# EAGLE board octanis_v1 (EAGLE 7.2.0)
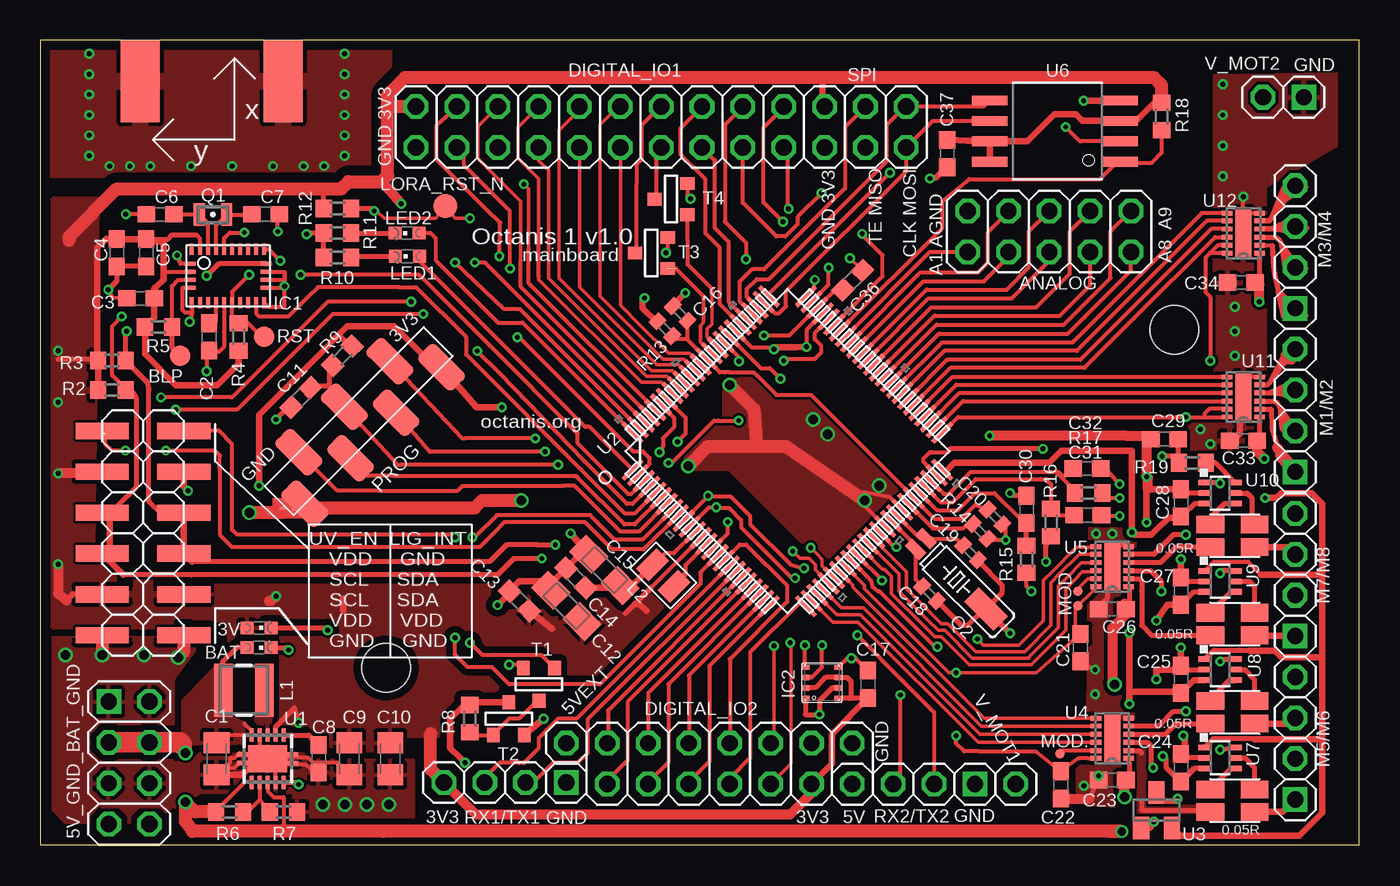
[diagram p2: board, top side]
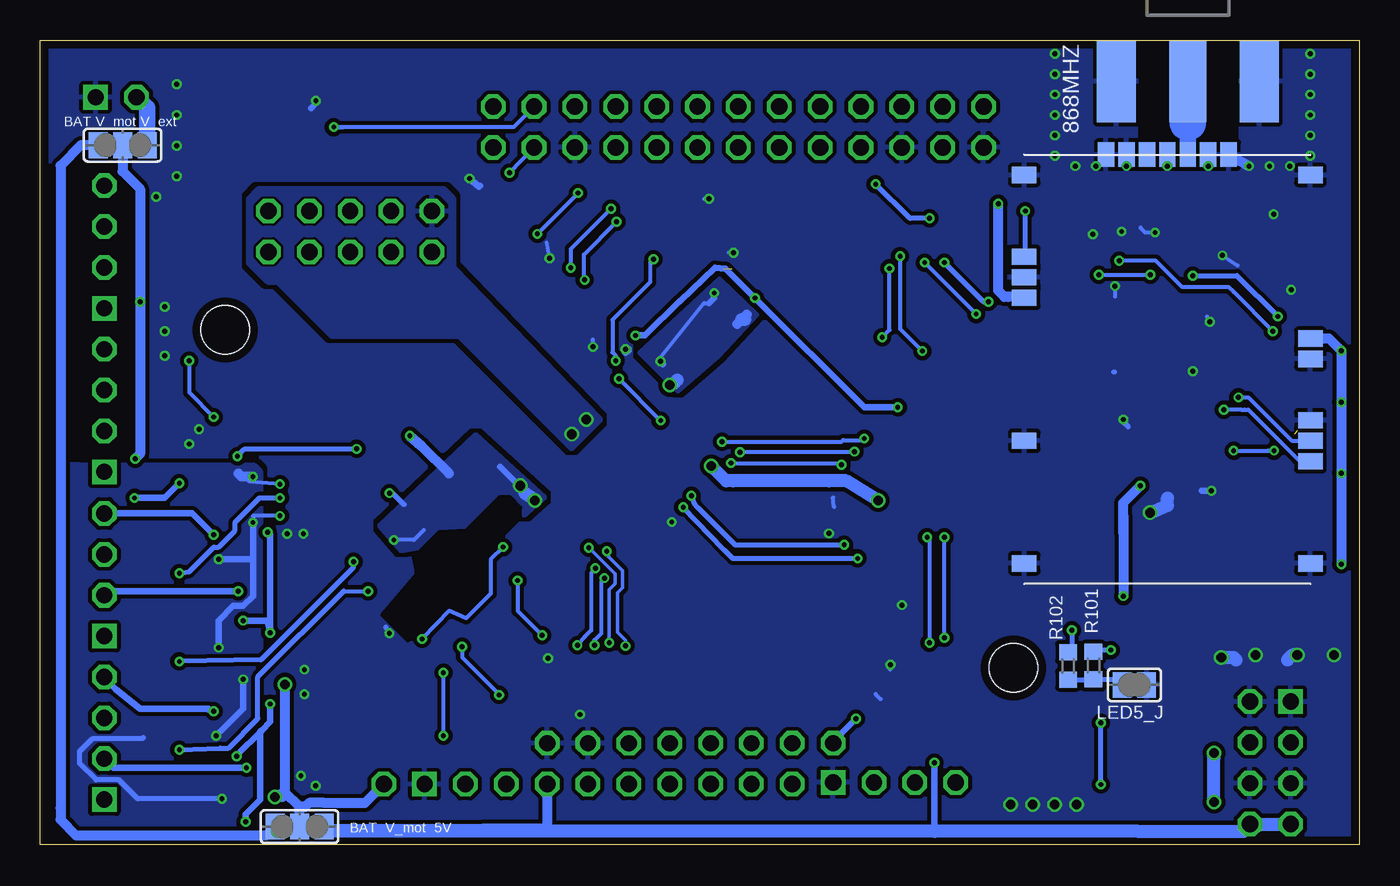
[diagram p3: board, bottom side, seen from below]

Size 82 x 50 mm. Coordinates in mm from the lower left corner, seen from the top.
Outline: 0,0 82,0 82,50 0,50 0,0
Copper layers (1*16): Top 0.035mm / dielectric 1.6mm / Bottom 0.035mm
Design rules "Elecrow_2-layer_PCB_eagle_rule": minimum track width 6mil, minimum drill 12mil, track to track 6mil, track to pad 6mil, pad to pad 6mil, via to via 8mil, smd to smd 0mil, copper to edge 20mil, drill to drill 10mil, minimum pad ring 6mil, minimum via ring 6mil, stop-mask expansion 0mil, vias tented up to drill 100mil, thermal gap 10mil
Net classes: 0 default: width 0.203 mm; 1 power: width 0.203 mm, drill 0.305 mm, clearance 0.152 mm; 2 VIN: width 0.203 mm, drill 0.305 mm, clearance 0.152 mm; 3 fine: width 0.406 mm, drill 0.61 mm, clearance 0.152 mm
Holes 3 mm at 70.5,32 21.5,11

## Footprints (pad centres in the part's own frame; a part is rotated, then mirrored left to right if it is on the bottom)
CHIPLED_0603 = smd 0.8 x 0.8: A 0,-0.75; C 0,0.75
1X01 = drill 1.016 octagon: 1 0,0
SMA_EDGELAUNCH = smd 5.08 x 2.413: GND@1 2.54,-4.445; GND@2 2.54,4.445 | smd 5.08 x 2.413 bottom: GND@3 2.54,4.445; GND@4 2.54,-4.445 | smd 5.08 x 2.286: P 2.54,0
2X05 = drill 1.016 octagon: 1 -5.08,-1.27; 2 -5.08,1.27; 3 -2.54,-1.27; 4 -2.54,1.27; 5 0,-1.27; 6 0,1.27; 7 2.54,-1.27; 8 2.54,1.27; 9 5.08,-1.27; 10 5.08,1.27
B1,27 = smd 1.27 x 1.27: TP 0,0
C0805K = smd 1.3 x 1.6: 1 -1,0; 2 1,0
C0603 = smd 1.1 x 1: 1 -0.85,0; 2 0.85,0
A/3216-18R = smd 1.95 x 1.5: + 1.375,0; - -1.375,0
C0402 = smd 0.7 x 0.9: 1 -0.65,0; 2 0.65,0
2X11 = drill 1.016 octagon: 1 -12.7,-1.27; 2 -12.7,1.27; 3 -10.16,-1.27; 4 -10.16,1.27; 5 -7.62,-1.27; 6 -7.62,1.27; 7 -5.08,-1.27; 8 -5.08,1.27; 9 -2.54,-1.27; 10 -2.54,1.27; 11 0,-1.27; 12 0,1.27; 13 2.54,-1.27; 14 2.54,1.27; 15 5.08,-1.27; 16 5.08,1.27; 17 7.62,-1.27; 18 7.62,1.27; 19 10.16,-1.27; 20 10.16,1.27; 21 12.7,-1.27; 22 12.7,1.27
BNO055 = smd 0.675 x 0.25: 1 1.663,2.25; 6 -1.665,2.25; 7 -1.665,1.75; 8 -1.665,1.25; 9 -1.665,0.75; 10 -1.665,0.25; 11 -1.665,-0.25; 12 -1.665,-0.75; 13 -1.665,-1.25; 14 -1.665,-1.75; 15 -1.665,-2.25; 20 1.663,-2.25; 21 1.663,-1.75; 22 1.663,-1.25; 23 1.663,-0.75; 24 1.663,-0.25; 25 1.663,0.25; 26 1.663,0.75; 27 1.663,1.25; 28 1.663,1.75 | smd 0.25 x 0.675: 2 0.75,2.362; 3 0.25,2.362; 4 -0.25,2.362; 5 -0.75,2.362; 16 -0.75,-2.362; 17 -0.25,-2.362; 18 0.25,-2.362; 19 0.75,-2.362
BME280 = smd 0.35 x 0.5: 1 0.975,-1.025; 2 0.325,-1.025; 3 -0.325,-1.025; 4 -0.975,-1.025; 5 -0.975,1.025; 6 -0.325,1.025; 7 0.325,1.025; 8 0.975,1.025
2X04 = drill 1.016 square: 1 -3.81,-1.27 | drill 1.016 octagon: 2 -3.81,1.27; 3 -1.27,-1.27; 4 -1.27,1.27; 5 1.27,-1.27; 6 1.27,1.27; 7 3.81,-1.27; 8 3.81,1.27
2X02 = drill 1.016 octagon: 1 -1.27,-1.27; 2 -1.27,1.27; 3 1.27,-1.27; 4 1.27,1.27
2X06SMD = smd 1.016 x 3.302: 1 -1.27,-3.81; 2 -1.27,1.27; 3 1.27,-3.81; 4 1.27,1.27; 5 3.81,-3.81; 6 3.81,1.27; 7 6.35,-3.81; 8 6.35,1.27; 9 8.89,-3.81; 10 8.89,1.27; 11 11.43,-3.81; 12 11.43,1.27
LPS3015 = smd 1.14 x 3.3: 1 -1.27,0; 2 1.27,0
0806 = smd 1.1 x 1.8: 1 -0.94,0; 2 0.94,0
SJ = smd 1.168 x 1.6: 1 -0.762,0; 2 0.762,0
TP15R = smd 1.5 x 1.5: TP 0,0
1X04-S = drill 1.016 square: 1 -3.81,0 | drill 1.016 octagon: 2 -1.27,0; 3 1.27,0; 4 3.81,0
TP06R = smd 0.6 x 0.6: TP 0,0
1X7SMD = smd 3.048 x 1.524: 1 -1.27,6; 2 1.27,4; 3 -1.27,2; 4 1.27,0; 5 -1.27,-2; 6 1.27,-4; 7 -1.27,-6
FC-12M = smd 0.7 x 1.4: 1 -0.85,0; 2 0.85,0
MS3V-T1R = smd 0.635 x 1.27: P1 -0.47,-4.43; P2 0.47,-4.43 | smd 1.27 x 2.54: P3 0,1.3
R0603 = smd 1 x 1.1: 1 -0.85,0; 2 0.85,0
R0402 = smd 0.7 x 0.9: 1 -0.65,0; 2 0.65,0
4PADS_RESISTOR = smd 1.727 x 1.1: I1 0,0; I2 2.751,0; V1 0,1.4; V2 2.751,1.4
SOT-23 = smd 0.787 x 0.889: 1 0.025,-1.016; 2 -0.94,1.016; 3 0.991,1.016
S-PDSO-N10 = smd 0.28 x 0.85: 1 -1,-1.475; 2 -0.5,-1.475; 3 0,-1.475; 4 0.5,-1.475; 5 1,-1.475; 6 1,1.475; 7 0.5,1.475; 8 0,1.475; 9 -0.5,1.475; 10 -1,1.475 | smd 2.4 x 1.65: PP 0,0 | smd 3.8 x 0.28: PP@1 0,0.275; PP@2 0,-0.275
PZ100 = smd 1.676 x 0.279: 1 -7.62,5.994; 2 -7.62,5.512; 3 -7.62,5.004; 4 -7.62,4.496; 5 -7.62,3.988; 6 -7.62,3.505; 7 -7.62,2.997; 8 -7.62,2.489; 9 -7.62,2.007; 10 -7.62,1.499; 11 -7.62,0.991; 12 -7.62,0.508; 13 -7.62,0; 14 -7.62,-0.508; 15 -7.62,-0.991; 16 -7.62,-1.499; 17 -7.62,-2.007; 18 -7.62,-2.489; 19 -7.62,-2.997; 20 -7.62,-3.505; 21 -7.62,-3.988; 22 -7.62,-4.496; 23 -7.62,-5.004; 24 -7.62,-5.512; 25 -7.62,-5.994; 51 7.62,-5.994; 52 7.62,-5.512; 53 7.62,-5.004; 54 7.62,-4.496; 55 7.62,-3.988; 56 7.62,-3.505; 57 7.62,-2.997; 58 7.62,-2.489; 59 7.62,-2.007; 60 7.62,-1.499; 61 7.62,-0.991; 62 7.62,-0.508; 63 7.62,0; 64 7.62,0.508; 65 7.62,0.991; 66 7.62,1.499; 67 7.62,2.007; 68 7.62,2.489; 69 7.62,2.997; 70 7.62,3.505; 71 7.62,3.988; 72 7.62,4.496; 73 7.62,5.004; 74 7.62,5.512; 75 7.62,5.994 | smd 0.279 x 1.676: 26 -5.994,-7.62; 27 -5.512,-7.62; 28 -5.004,-7.62; 29 -4.496,-7.62; 30 -3.988,-7.62; 31 -3.505,-7.62; 32 -2.997,-7.62; 33 -2.489,-7.62; 34 -2.007,-7.62; 35 -1.499,-7.62; 36 -0.991,-7.62; 37 -0.508,-7.62; 38 0,-7.62; 39 0.508,-7.62; 40 0.991,-7.62; 41 1.499,-7.62; 42 2.007,-7.62; 43 2.489,-7.62; 44 2.997,-7.62; 45 3.505,-7.62; 46 3.988,-7.62; 47 4.496,-7.62; 48 5.004,-7.62; 49 5.512,-7.62; 50 5.994,-7.62; 76 5.994,7.62; 77 5.512,7.62; 78 5.004,7.62; 79 4.496,7.62; 80 3.988,7.62; 81 3.505,7.62; 82 2.997,7.62; 83 2.489,7.62; 84 2.007,7.62; 85 1.499,7.62; 86 0.991,7.62; 87 0.508,7.62; 88 0,7.62; 89 -0.508,7.62; 90 -0.991,7.62; 91 -1.499,7.62; 92 -2.007,7.62; 93 -2.489,7.62; 94 -2.997,7.62; 95 -3.505,7.62; 96 -3.988,7.62; 97 -4.496,7.62; 98 -5.004,7.62; 99 -5.512,7.62; 100 -5.994,7.62
MAX6001 = smd 1 x 1.4: 1 -0.95,-1.1; 2 0.95,-1.1; 3 0,1.1
SON50P200X300X80-13N = smd 0.66 x 0.305: 1 -1.016,1.245; 2 -1.016,0.762; 3 -1.016,0.254; 4 -1.016,-0.254; 5 -1.016,-0.762; 6 -1.016,-1.245; 7 1.016,-1.245; 8 1.016,-0.762; 9 1.016,-0.254; 10 1.016,0.254; 11 1.016,0.762; 12 1.016,1.245 | smd 0.991 x 3.099: 13 0,0
SOIC_8-LEAD = smd 0.61 x 2.21: CE -1.905,-2.934; RST/HOLD -0.635,5.156; SCK 0.635,5.156; SI 1.905,5.156; SO -0.635,-2.934; VDD -1.905,5.156; VSS 1.905,-2.934; WP 0.635,-2.934
SC70-6 = smd 0.35 x 0.8: 1 -0.65,-0.95; 2 0,-0.95; 3 0.65,-0.95; 4 0.65,0.95; 5 0,0.95; 6 -0.65,0.95
RN2483 = smd 1.524 x 1.016: P$1 17.78,1.27; P$6 17.78,7.62; P$7 17.78,8.89; P$8 17.78,10.16; P$11 17.78,13.97; P$12 17.78,15.24; P$20 17.78,25.4; P$28 0,25.4; P$32 0,20.32; P$33 0,19.05; P$34 0,17.78; P$41 0,8.89; P$47 0,1.27 | smd 1.016 x 1.524: P$21 12.7,26.67; P$22 11.43,26.67; P$23 10.16,26.67; P$24 8.89,26.67; P$25 7.62,26.67; P$26 6.35,26.67; P$27 5.08,26.67
STAR = smd 0.152 x 0.305: AGND 0.635,-0.635; DGND 0.635,0.635 | smd 0.305 x 0.152: GND 0.635,0
1X02-S = drill 1.016 square: 1 -1.27,0 | drill 1.016 octagon: 2 1.27,0
SJ_2 = smd 1.168 x 1.6: 1 -1.524,0; 2 0,0; 3 1.524,0

## Placement (x,y rotation side)
3V  3V-ok  [CHIPLED_0603]  13.61,13.48 270 top
5VEXT  [1X01]  32.71,6.32 0 top
868MHZ  [SMA_EDGELAUNCH]  10.66,49.98 270 bottom
ANALOG  [2X05]  62.73,38.12 0 top
BAT  BAT-ok  [CHIPLED_0603]  13.61,12.26 270 top
BLP  PTR1B1,27  [B1,27]  8.71,30.4 180 top
C1  10u  [C0805K]  10.96,5.35 270 top
C2  100n  [C0603]  10.51,31.56 90 top
C3  100n  [C0603]  6.24,33.96 180 top
C4  120n  [C0603]  4.77,36.8 270 top
C5  120n  [C0603]  6.6,36.8 270 top
C6  12p  [C0603]  7.46,39.18 180 top
C7  12p  [C0603]  14.01,39.18 0 top
C8  100n  [C0603]  17.31,5.35 270 top
C9  10u  [C0805K]  19.22,5.35 270 top
C10  10u  [C0805K]  21.76,5.35 270 top
C11  1n  [C0603]  16.2,27.8 45 top
C12  10u  [A/3216-18R]  32.71,14.85 315 top
C13  100n  [C0603]  29.79,15.16 315 top
C14  100n  [C0603]  33.29,16.58 315 top
C15  10u  [A/3216-18R]  35.07,17.09 315 top
C16  100n  [C0402]  39.78,33.03 135 top
C17  100n  [C0603]  51.47,9.98 90 top
C18  12p  [C0402]  55.29,15.62 135 top
C19  12p  [C0402]  57.83,18.16 135 top
C20  100n  [C0402]  59.36,20.37 315 top
C21  470n  [C0603]  64.66,12.26 270 top
C22  470n  [C0603]  63.44,3.72 270 top
C23  470n  [C0603]  66.64,4.03 0 top
C24  10n  [C0603]  70.91,4.79 270 top
C25  10n  [C0603]  70.91,10.28 270 top
C26  470n  [C0603]  66.64,14.65 0 top
C27  10n  [C0603]  70.91,15.76 270 top
C28  10n  [C0603]  70.91,21.25 270 top
C29  470n  [C0603]  69.89,25.21 0 top
C30  470n  [C0603]  61.31,20.84 270 top
C31  470n  [C0603]  65.12,20.49 180 top
C32  470n  [C0603]  65.07,23.38 180 top
C33  470n  [C0603]  74.8,25.12 0 top
C34  470n  [C0603]  74.66,34.94 0 top
C36  100n  [C0603]  50.51,35.09 225 top
C37  100n  [C0603]  56.38,42.95 270 top
DIGITAL_IO1  [2X11]  36.06,44.61 180 top
DIGITAL_IO2  [2X05]  40.33,5.05 0 top
IC1  BNO055A  [BNO055]  11.68,35.36 90 top
IC2  BME280  [BME280]  48.6,10.08 270 top
JP2  [2X04]  5.53,5.1 270 top
JP3  [2X02]  49.22,5.05 0 top
JP4  [2X06SMD]  7.66,24.45 270 top
L1  LPS3015  [LPS3015]  12.67,9.62 0 top
L2  4.7uH  [0806]  38.73,16.73 315 top
LED1  LED1  [CHIPLED_0603]  22.83,36.57 90 top
LED2  LED0  [CHIPLED_0603]  22.8,38.02 90 top
LED5_J  [SJ]  13.98,9.94 180 bottom
LORA_RST_N  PTR1TP15R  [TP15R]  25.19,39.69 0 top
M1/M2  [1X04-S]  78.02,26.99 90 top
M3/M4  [1X04-S]  78.02,37.15 90 top
M5/M6  [1X04-S]  78.02,6.62 90 top
M7/M8  [1X04-S]  78.02,16.78 90 top
MOD  TPTP06R  [TP06R]  64.51,15.76 0 top
MOD.  TPTP06R  [TP06R]  63.39,5.65 0 top
PROG  [1X7SMD]  19.8,26.33 135 top
Q1  32.768kHz  [FC-12M]  10.74,39.17 180 top
Q2  32.768kHz  [MS3V-T1R]  57.88,15.57 225 top
R2  4.7k  [R0603]  4.46,28.26 180 top
R3  4.7k  [R0603]  4.46,30.09 180 top
R4  100k  [R0603]  12.34,31.56 90 top
R5  100k  [R0603]  7.36,32.18 180 top
R6  1M  [R0603]  11.78,2.05 180 top
R7  1M  [R0603]  15.13,2.05 180 top
R8  1M  [R0603]  26.71,7.84 90 top
R9  47k  [R0603]  18.79,30.39 225 top
R10  1k  [R0603]  18.48,36.49 0 top
R11  1k  [R0603]  18.48,38.01 0 top
R12  100k  [R0603]  18.48,39.54 180 top
R13  0R  [R0402]  38.83,32.08 135 top
R14  91k 0.1% ±25 ppm/°C  [R0402]  58.44,19.48 315 top
R15  6.8k  [R0603]  61.31,17.75 270 top
R16  6.8k  [R0603]  62.83,20.03 270 top
R17  6.8k  [R0603]  65.17,21.86 0 top
R18  10k  [R0603]  69.71,45.26 90 top
R19  6.8k  [R0603]  71.62,23.74 0 top
R101  2k  [R0603]  16.53,11.14 90 bottom
R102  1k  [R0603]  18.1,11.12 90 bottom
RS1  0.05R  [4PADS_RESISTOR]  72.74,2.05 0 top
RS2  0.05R  [4PADS_RESISTOR]  72.74,7.53 0 top
RS3  0.05R  [4PADS_RESISTOR]  72.74,13.02 0 top
RS4  0.05R  [4PADS_RESISTOR]  72.74,18.51 0 top
RST  PTR1B1,27  [B1,27]  13.91,31.57 180 top
RX1/TX1  [1X04-S]  28.9,3.88 180 top
RX2/TX2  [1X04-S]  54.3,3.78 180 top
SPI  [2X02]  52.57,44.61 0 top
T1  [SOT-23]  30.98,9.97 0 top
T2  [SOT-23]  29.15,7.84 180 top
T3  [SOT-23]  37.99,36.8 270 top
T4  [SOT-23]  39.21,40.15 270 top
U1  TPS61201  [S-PDSO-N10]  14.14,5.35 180 top
U2  MSP432  [PZ100]  46.45,24.45 45 top
U3  MAX6001SOT-23  [MAX6001]  69.38,2.15 0 top
U4  DRV8836DSSR  [SON50P200X300X80-13N]  66.64,6.62 180 top
U5  DRV8836DSSR  [SON50P200X300X80-13N]  66.64,17.29 180 top
U6  SST25VF064C  [SOIC_8-LEAD]  64.18,44.35 90 top
U7  INA210  [SC70-6]  73.35,5.4 270 top
U8  INA210  [SC70-6]  73.35,10.89 270 top
U9  INA210  [SC70-6]  73.35,16.37 270 top
U10  INA210  [SC70-6]  73.35,21.86 270 top
U11  DRV8836DSSR  [SON50P200X300X80-13N]  74.79,27.83 180 top
U12  DRV8836DSSR  [SON50P200X300X80-13N]  74.79,38.02 180 top
U100  RN2483  [RN2483]  20.82,16.22 0 bottom
U$1  WEATHER_STRIP_DOCU  [WEATHER_STRIP_DOCU]  21.76,17.36 0 top
U$2  STARGND  [STAR]  15.71,21.55 270 top
U$3  BNO055_COORDINATES  [BNO055_COORDINATES]  12.08,43.81 0 top
V_MOT1  [1X02-S]  59.38,3.78 0 top
V_MOT2  [1X02-S]  77.28,46.46 180 top
VCCMOT  TPTP06R  [TP06R]  64.51,14.85 0 top
VMOT_SEL  3V3 V_Motor 5V  [SJ_2]  76.88,43.48 0 bottom
VMOT_SEL100  3V3 V_Motor 5V  [SJ_2]  65.88,1.13 0 bottom

## Tracks (layer width: path | path; a pad name or v marks a point on that pad's centre or on a via)
3V3_MODULE2  (via drill 0.5, 0.6)
  Top 0.254: U1.6 12.69,3.88 12.54,3.72 | 12.54,3.72 11.78,2.96 | R6.2 11.05,2.24 12.54,3.72 | U1.8 14.14,3.34 14.52,2.96 15.13,2.96 15.13,0.83 | 12.69,7.53 13.14,7.09 U1.5 11.68,6.83 11.47,6.62 11.2,6.35 C1.1
  Top 0.305: BAT.A 12.26,12.28 11.32,11.34 11.32,9.69 L1.1
  Top 0.813: 66.49,0.83 v67.25,0.83 66.49,0.83 | 66.49,0.83 21.33,0.83 15.13,0.83 9.47,0.83 9.03,1.44 v9.03,2.66 9.64,2.05 R6.2 | v9.03,5.71 9.03,6.01 8.81,6.24 8.73,6.32
  Top 1.27: JP2.3 JP2.4 | JP2.4 8.68,6.37 | 8.68,6.37 8.73,6.32 | JP2.4 8.68,6.37 | 8.68,6.37 8.81,6.24
  Bottom 0.61: v67.25,0.83 VMOT_SEL100.1 67.96,0.57 71.21,0.57 78.38,0.57 79.75,0.57 80.74,1.56 80.74,2.28 80.74,42.2 79.44,43.5 78.83,43.5 78.81,43.48 VMOT_SEL.1
  Bottom 0.813: v9.03,2.66 9.03,5.4 v9.03,5.71
  pour Top (isolate 0.406, rank 3): 11.68,11.06 10.94,11.06 7.51,7.53 3.55,7.53 2.94,6.92 2.94,5.71 3.55,5.1 7.51,5.1 13.2,6.32 13.3,7.23 11.78,7.92
5V_EN  (via drill 0.3)
  Top 0.254: U2.8 37.44,18.96 35.86,18.96 35.7,18.96 34.18,20.49 28.39,20.49 27.02,19.12 v26.86,19.12 | v26.71,12.56 27.48,11.8 31.13,11.8 31.95,10.99 T1.3
  Bottom 0.254: v26.86,19.12 26.71,18.96 v26.71,12.56
+3V3  (via drill 0.3)
  Top 0.254: U2.13 38.02,16.02 | 48.26,33.38 U2.73 | v45,31.65 46.57,31.65 U2.73 | C36.2 49.58,34.66 U2.73 | 9.93,37.44 IC1.28 9.93,37.69 9.72,37.9 | R4.1 12.71,30.34 | C17.1 51.44,9.1 | 17.63,40.85 17.72,40.93 17.72,40.76 | 17.57,30.62 17.49,30.62 | IC1.3 9.29,35.58 7.66,35.58
  Top 0.3: U1.10 15.95,3.88 v16.07,3.75 | v16.07,7.59 15.82,8.53 14.83,7.53
  Top 0.305: IC2.2 47.59,9.77 48.19,9.77 48.73,10.32 48.82,10.4 IC2.6 50.16,10.4 50.39,10.18 50.39,9.21 50.49,9.1 | 38.02,16.02 37.95,15.95 36.96,14.96 36.38,14.39 | 12.23,30.61 R4.1 | 51.44,9.1 50.49,9.1 | 50.49,9.1 50.28,9.1 IC2.8 | R12.2 17.63,40.85 | R9.1 19.25,31 18.56,31.69 | 3.4,30.31 3.25,30.17 1.11,30.17 | C5.1 7.95,37.65 8.2,37.9 9.72,37.9 | U1.2 14.64,7.35 14.83,7.53 14.98,7.69
  Top 0.406: 18.84,14.53 18.84,15.29 | R13.2 38.27,32.53 37.46,33.35 37.46,33.88 v37.56,33.98 | U6.RST/HOLD 60.62,43.71 61.37,43.71 63.06,45.41 64.37,45.41 64.79,44.98 U6.WP 67.16,45.02 68.17,45.02 69.25,46.11 R18.2 | U6.RST/HOLD U6.VDD | C37.1 56.49,43.8 57.65,43.74 59,43.74 U6.RST/HOLD | 7.14,33.88 C3.1 | DIGITAL_IO1.1 48.63,46 48.63,47.32 48.63,47.49 48.43,47.69 | C12.+ 33.58,14.49 | 31.83,13.42 C13.2 | 37.69,14.54 37.27,14.96 36.96,14.96 | 3.55,27.96 3.55,28.26 R2.2 R3.2 3.4,30.31 3.55,30.31 3.55,37.1 4.11,37.66 4.12,37.65 C4.1 C5.1 | v28.69,27.19 27.12,27.19 PROG.7 | R4.1 12.34,29.89 12.03,29.58 11.02,28.57 8.43,28.57 6.51,30.48 R5.2 7.09,32.76 C3.1 | 23.93,30.29 21.99,32.22 19.09,32.22 18.56,31.69 17.49,30.62 13.61,26.74 13.61,23.69 v13.61,22.32 | JP3.1 49.22,5.04 49.22,6.88 C17.1 | 2.02,15.56 1.64,15.18 | C5.1 | C3.1 7.09,34.52 7.21,34.67 7.66,35.12 7.66,35.58 7.66,36.03 7.66,37.34 7.5,37.5 6.69,37.5 6.6,37.4 C5.1
  Top 0.61: v14.67,15.46 14.37,15.15 14.22,15.15 | v1.11,17.44 1.11,15.61 1.64,15.18 | PROG.7 23.93,30.29 | 2.73,23.08 v1.11,23.08 | v22.45,39.84 21.23,41.22 | RX1/TX1.4 27.07,1.9 46.63,1.9 47.95,3.22 JP3.1
  Top 0.813: 1.79,37.56 1.79,37.79 4.77,40.76 17.72,40.76 18.71,40.76 19.17,41.22 21.23,41.22 21.61,41.6 21.61,45.86 | 21.61,45.86 21.61,46.62 22.67,47.69 48.2,47.69 48.43,47.69 69.23,47.69 69.54,47.39 69.71,47.22 R18.2 | DIGITAL_IO1.21 23.35,45.86 21.61,45.86 | RX1/TX1.4 24.27,4.69 24.27,6.92
  Bottom 0.3: v16.07,3.75 v16.07,7.59
  Bottom 0.305: U100.P$12 2.96,31.38 1.87,31.38
  Bottom 0.406: v45,31.65 44.39,31.65 42.27,33.78 42.23,33.78 40.05,35.86 39.39,35.81 v37.56,33.98 30.77,27.19 v28.69,27.19 | v1.11,23.08 1.11,23.54
  Bottom 0.61: 14.67,20.49 14.67,19.42 | 14.67,19.42 v14.67,15.46 | v1.11,17.44 v1.11,23.08 1.11,23.54 v1.11,27.5 1.11,27.8 v1.11,30.7 1.87,31.46 U100.P$12 | 14.67,19.42 14.67,21.25 v13.61,22.32 | v22.45,39.84 22.45,37.41 22.45,34.43 22.07,34.05 21.84,34.05 20.87,34.05 U100.P$34
  pour Top: 0.86,13.58 8.12,13.58 8.12,17.69 3.24,18.35 3.5,40.1 0.86,40.1
  pour Top (isolate 0.406, rank 4): 0.96,16.42 39.16,16.73 39.36,6.82 11.83,6.67 11.73,13.94 0.8,13.78
  pour Top: 14.98,7.53 14.98,12.87 20.62,12.87 22.45,11.04 22.45,6.77 21.53,5.86 18.33,5.86 16.65,7.53
+5V  (via drill 0.3)
  Top 0.406: T2.1 27.18,8.86 R8.2 26.34,8.69 25.49,7.84 25.49,6.01 26.1,5.4 v26.41,5.1
  Bottom 0.406: 7.21,0.83 7.21,0.88 JP2.8 | v26.41,5.1 26.41,4.79 26.41,0.83
  Bottom 0.61: 54.45,1 64.09,1 64.22,1 VMOT_SEL100.3 | 54.45,1 50.49,1 | 50.49,1 JP3.3 50.49,1 | 50.49,1 54.45,1
  Bottom 0.813: 7.21,0.83 13.74,0.83 26.41,0.83 64.05,0.83 VMOT_SEL100.3 | JP2.8 JP2.7
A1
  Top 0.254: U2.68 55.32,36.85 ANALOG.1
A2
  Top 0.254: U2.67 54.73,35.58 57.65,35.58 58.31,35.58 58.92,36.19 58.92,38.06 60.19,39.34 ANALOG.4
A3
  Top 0.254: U2.66 54.89,35.02 58.67,35.02 60.19,36.54 ANALOG.3
A4
  Top 0.254: U2.65 55.1,34.51 60.09,34.51 61.46,35.88 61.46,38.12 ANALOG.6
A5
  Top 0.254: U2.64 55.23,33.95 60.39,33.95 61.26,34.81 62.73,36.29 ANALOG.5
A6
  Top 0.254: U2.63 55.39,33.39 61.92,33.39 62.53,34 64,35.47 64,38.12 ANALOG.8
A7
  Top 0.254: U2.62 55.6,32.88 63.39,32.88 63.8,33.29 65.27,34.76 ANALOG.7
A8
  Top 0.254: U2.61 55.72,32.33 63.64,32.33 65.12,33.8 66.54,35.22 66.54,38.12 ANALOG.10
A9
  Top 0.254: U2.60 55.88,31.77 63.9,31.77 64.91,32.78 66.34,34.2 67.81,35.68 ANALOG.9
A20  (via drill 0.3)
  Top 0.254: U2.49 55.06,23.64 54.91,23.79 54.91,23.99 55.31,24.4 55.41,24.4 56.38,24.4 56.43,24.45
  Top 0.305: 70.74,23.77 R19.1 70.74,23.77 | 70.74,23.77 70.36,24.15 v69.74,24.15 | 70.74,23.77 C29.2 | v62.32,24.6 56.58,24.6 56.43,24.45
  Bottom 0.305: v69.74,24.15 69.28,24.6 v62.32,24.6
A20UNF
  Top 0.305: U10.6 73.07,23.74 R19.2
A21
  Top 0.254: U2.48 56.17,21.81 56.58,21.81 56.58,21.91 57.85,23.18 63.14,23.18 | C32.2 63.64,22.88 63.29,23.18 63.14,23.18 | R17.1 64.32,22 63.14,23.18
A21UNF  (via drill 0.3)
  Top 0.254: R17.2 66.02,21.55 v67.1,21.55
  Top 0.305: U9.6 73.39,17.02 v73.35,16.88
  Bottom 0.305: v73.35,16.88 72.74,16.98 71.21,18.51 70.91,18.51 69.89,19.52 69.89,20.03 68.37,21.55 67.4,21.55 v67.1,21.55
A22
  Top 0.254: C31.2 63.22,20.49 R16.1 62.83,22.42 62.53,22.72 62.17,22.72 58.16,22.72 56.74,21.3 55.96,21.3 U2.47
A22UNF  (via drill 0.3)
  Top 0.305: v73.35,11.39 73.39,11.54 U8.6 | v62.53,17.59 62.53,18.57 R16.2
  Bottom 0.305: v73.35,11.39 68.27,11.5 67.86,11.9 63.8,15.97 62.53,17.24 v62.53,17.59
A23
  Top 0.254: U2.46 55.75,20.79 57.04,20.79 58.11,21.86 59.33,21.86 60.94,20.25 C30.2
  Top 0.305: R15.1 C30.2 60.94,20.25
A23UNF  (via drill 0.3)
  Top 0.254: U7.6 74.26,6.01 | v61.61,15.76 61.31,16.07 R15.2
  Top 0.305: 74.26,6.01 v73.35,5.91
  Bottom 0.254: 63.14,15.76 v61.61,15.76
  Bottom 0.305: 70.81,6.01 v73.35,5.91 70.81,6.01 | 70.81,6.01 70.3,6.01 68.47,7.84 68.47,10.43 63.14,15.76
ACCEL_INT
  Top 0.254: U2.5 36.93,20.58 36.37,20.58 33.62,23.32 27.12,29.82 26.46,30.48 26.46,31.56 23.36,34.66 22.28,34.66 17.26,34.66 16.65,34.05 15.44,32.83 13.61,32.83 13.43,33.01 IC1.14
ACCEL_N_BOOTLD
  Top 0.254: R5.1 8.2,33.24 8.2,34.72 8.59,35.11 IC1.4
  Top 0.305: BLP.TP 8.21,30.9 R5.1
ACCEL_N_RST  (via drill 0.3)
  Top 0.254: U2.3 36.72,21.8 36.57,21.8 33.93,24.44 33.42,24.95 33.42,25.55 27.93,31.04 27.63,31.35 23.55,35.42 16.65,35.42 v16.2,35.42 | v13,35.42 11.93,34.36 IC1.11 11.93,32.45 R4.2 12.92,32.41 13.46,31.88 RST.TP
  Bottom 0.254: v16.2,35.42 v13,35.42
AGND  (via drill 0.3, 0.6)
  Top 0.203: C20.2 59.67,20.1 59.81,19.96
  Top 0.254: U2.40 51.21,21.09 | U2.43 52.83,21.6 51.21,21.91 | R14.2 58.97,18.94 v60.01,18.94 60.01,19.76 59.81,19.96 | U2.84 43.59,30.15 v43.44,30.04 | C31.1 66.17,20.44 v67.1,20.44 | C32.1 66.23,23.38 v67.1,22.42 | C29.1 68.83,25.21 68.78,25.26
  Top 0.305: C20.2 59.71,20.06 | 71.15,5.4 C24.1 arc90 71.15,5.4 | U7.2 71.15,5.4 | U10.2 71.15,21.86 C28.1 | C27.1 71.15,16.37 U9.2 | C25.1 71.15,10.89 U8.2 | U3.3 69.4,3.25 69.94,2.71 70.55,2.71 v70.71,2.86 | C30.1 60.51,21.69 v60.29,21.86
  Top 0.406: C16.2 39.32,33.52 v40.1,34.3 | 71.15,5.4 71.15,6.68 v71.06,6.77 | 69.39,10.89 70.45,10.89 | 70.45,10.89 70.67,10.89 C25.1 v70.91,12.26 | v69.39,10.28 69.39,10.89 | 69.39,10.89 70.45,10.89 | C27.1 v70.91,17.75 | v68.78,20.03 68.78,22.01 68.86,22.1 C28.1
  Top 0.61: v68.78,22.88 68.78,22.98 | v59.02,25.42 67.56,25.42 68.78,25.42 68.78,25.26 v68.78,22.88 | 68.86,22.1 68.86,22.79 v68.78,22.88
  Top 0.813: v40.28,23.54 41.5,24.76 44.54,24.76 | 44.54,24.76 44.39,27.04 v42.87,28.57 | 44.54,24.76 46.37,24.76 v51.25,21.4 | U$2.AGND 16.3,21.61 16.3,21.45 16.81,20.95 27.02,20.95 27.48,21.4 v29.91,21.4
  Bottom 0.254: 43.6,30.08 40.73,33.66 40.42,33.66 | 58.16,19.55 58.77,18.94 v60.01,18.94 | v67.1,20.44 68.78,20.44 v68.78,20.03 | v67.1,22.42 68.98,22.57 69.28,22.88
  Bottom 0.305: v70.71,2.86 75.94,2.86 77.11,4.03 78.53,4.03 79.55,5.04 79.55,5.81 78.73,6.62 75.63,6.62 75.58,6.67 | v60.29,21.86 60.09,21.86 59.38,21.15
  Bottom 0.406: 51.85,21.91 53.12,23.18 53.42,23.5 | v43.44,30.04 43.27,29.85 | v40.1,34.3 40.1,33.98 40.42,33.66 | v71.06,6.77 69.39,8.45 v69.39,10.28 | v70.91,17.75 70.15,17.75 68.78,17.75 | 68.78,17.75 68.78,15.46 69.39,14.85 69.99,14.85 70.91,13.94 v70.91,12.26 | 68.78,17.75 v68.78,20.03
  Bottom 0.61: 38.07,32.96 38.4,32.63 38.68,32.35 | v59.02,25.42 58.31,24.81 56.58,23.08 | v68.78,22.88 69.28,22.88 69.49,22.88 69.69,23.08
  Bottom 0.813: 38.2,32.63 38.4,32.63 | v29.91,21.4 31.89,22.62 32.96,22.62 38.91,22.62 39.36,22.62 v40.28,23.54 | v42.87,28.57 42.56,28.72 42.41,28.87 | v51.25,21.4 51.88,21.86
  other vias: 48.05,26.43 48.96,25.52 52.16,22.32
  pour Bottom: 54.93,25.55 60.97,19.83 59.58,18.24 53.12,19.38 50.58,21.6
  pour Bottom: 39.78,35.24 44.8,30.58 42.35,28.13 39.81,30.32 37.38,32.94
  pour Bottom (isolate 0.254, no thermals): 68.67,23.59 78.63,23.59 80.41,23.64 80.15,-0.09 68.27,-0.19 68.27,23.18
  pour Bottom: 56.89,40.76 68.47,40.76 69.08,40.15 69.08,36.19 67.86,34.97 67.25,34.97 63.9,31.61 55.97,31.61 48.96,24.6 47.13,26.43 56.28,35.88 56.28,40.15
  pour Top: 40.12,23.99 42.56,26.43 42.56,28.26 43.17,28.87 43.48,28.87 43.78,29.18 45.61,30.09 53.84,22.47 52.32,21.25 48.96,17.9 48.35,17.9 42.87,23.38 40.73,23.38
ANT868
  Bottom 1.016: U100.P$23 10.66,44.26 | 10.66,44.26 10.66,44.31 10.66,45.69 868MHZ.P | 11.29,44.92 arc-90 10.66,44.26 | 10.66,44.26 arc-90 10.03,44.95
AVCC
  Top 0.254: 40.24,31.44 40.24,31.38 U2.87 42.26,29.36 42.56,29.36 42.87,29.36 43.13,29.36 44.35,29.36 44.54,29.18 45.76,27.96 47.91,27.96 53.31,22.55 U2.45 55.59,20.27 57.28,20.27 58.14,21.14 C20.1 | 40.24,31.44 C16.1 | R13.1 39.47,31.44 40.24,31.44
CURR_SENSE_EN  (via drill 0.3)
  Top 0.254: U2.50 56.25,23.13 arc90 56.33,23.13
  Top 0.305: U7.3 71.72,4.75 | 71.72,4.75 C24.2 | 71.72,4.75 71.72,4.69 | 71.72,4.69 70.91,3.88 | 71.72,4.75 71.72,4.69 | 71.72,4.69 70.91,3.88 | U10.3 71.78,21.21 71.52,20.95 71.45,20.95 C28.2 | C27.2 71.72,15.72 U9.3 | 56.33,23.13 56.38,23.28 | 70.91,3.88 69.99,4.79 69.99,5.4 v69.79,5.5
  Top 0.406: 67.71,9.36 67.86,9.52 70.52,9.52 70.67,9.67 C25.2 71.72,10.24 U8.3 | 67.71,9.36 v67.71,8.75 | C27.2 70.06,14.91 v69.39,13.94 | v67.71,13.17 67.71,9.36 | C28.2 70.84,20.34 70.15,20.34 69.39,19.57 69.08,19.27 68.62,19.27 68.01,19.27 v67.86,19.42 67.86,22.47 67.86,24.5 66.9,24.5 63.49,24.5 62.73,23.74 56.84,23.74 56.38,23.28 | U3.1 69,1.05 v69.23,1.44
  Bottom 0.406: 67.71,7.99 67.71,7.64 68.22,7.13 | 67.71,7.99 v67.71,8.75 67.71,7.99 | v69.39,13.94 67.86,13.94 v67.71,13.17 67.71,19.27 v67.86,19.42 | v69.79,5.5 69.84,5.5 68.22,7.13 | v69.23,1.44 69.23,1.9 68.32,2.81 68.32,7.03 68.22,7.13
EXT_LIGHTNING_INT  (via drill 0.3)
  Top 0.254: U2.16 41.04,16.92 41.04,16.22 34.79,9.97 29.15,9.97 28.08,11.04 26.56,11.04 25.8,11.8 v25.8,12.87 | v25.8,19.12 25.65,19.27 14.37,19.27 12.23,19.27 11.93,19.57 11.93,24.91 11.12,25.72 JP4.2
  Bottom 0.254: v25.8,12.87 v25.8,19.12
EXT_UV_EN  (via drill 0.3)  (1 unrouted)
  Top 0.254: v7.82,24.5 10.86,24.5 11.17,24.2 11.17,23.38 11.17,19.27 11.93,18.51 16.05,18.51 27.32,18.51 28.24,19.42 28.85,20.03 33.88,20.03 35.55,18.36 37.51,18.36 U2.9 | v5.3,24.5 4.46,24.5 4.06,24.91 4.06,25.52
  Bottom 0.254: v7.82,24.5 5.68,24.5 v5.3,24.5
GND  (via drill 0.3, 0.6)
  Top 0.203: 74.84,29.05 74.84,27.83 U11.13 | C36.1 50.97,35.86 v50.34,36.45 | C21.2 65.49,10.89 v65.58,10.89
  Top 0.254: v74.8,40.27 74.77,39.41 arc90 74.92,39.26 U12.6 | U11.6 74.87,29.07 arc90 74.84,29.05 | U2.82 44.21,30.93 45.65,30.93 v45.61,30.79 | U2.15 42.74,19.35 v42.74,20.06 | C6.2 v5.33,39.18 | C3.2 4.5,34 v4.24,34.49 | v10.36,29.43 10.36,30.65 C2.1 10.24,30.63 11.12,30.63 11.43,30.94 arc-1 IC1.10 | IC1.15 14.17,33.45 15.19,33.45 v15.19,34.72 | IC1.18 15.19,35.61 15.19,35.36 | 15.19,35.36 v15.19,34.72 | IC1.16 15.19,34.61 v15.19,34.72 | IC1.17 15.19,35.11 15.19,35.36 | IC1.6 9.43,33.41 9.44,33.09 | 9.44,33.09 v9.29,32.51 | IC1.2 8.72,36.11 v8.51,36.63 | IC1.25 11.43,37.7 11.78,38.05 v12.7,38.05 | 48.68,33.02 U2.72 47.8,32.16 47.64,32.01 v47.64,30.94 | IC1.5 8.83,34.61 8.83,33.24 8.98,33.09 9.44,33.09 | v14.78,38.12 14.78,39.03 C7.2 | C17.2 50.69,11.6 v50.42,11.6 50.17,11.6 IC2.5 | U1.PP@2 13.61,5.62 | 13.61,5.62 13.22,5.62 13.85,5 16.5,5 17,4.5 C8.2 16.96,4.86 16.96,5.1 | 12.39,5.1 12.08,4.79 11.47,4.79 11.78,5.1 11.78,5.4 12.08,5.4 12.39,5.71 | U1.9 14.64,4.98 14.52,5.1 14.16,5.1 U1.PP@1 | U1.4 13.64,5.66 13.61,5.62 | T3.2 39.01,36.9 v38.91,36.8 | T4.2 40.23,40.35 v40.43,40.15 | 16.96,5.1 16.65,5.4 14.52,5.4 | C9.2 18.47,5.1 16.96,5.1 | 65.25,2.87 C23.1 | T1.2 29.84,11.19 v29.15,11.19
  Top 0.305: IC2.1 47.57,8.1 v48.44,8.1 48.44,8.96 49.24,9.75 IC2.7 | 58.8,14.78 Q2.P3 | C26.1 65.84,14.81 66.34,15.31 66.34,16.98 U5.13 66.64,18.66 67.53,18.66 U5.6 | v16.55,37.95 16.59,37.99 17.51,37.99 17.61,37.99 R11.1 R10.1 17.51,36.37 | C11.1 15.44,27.2 v14.67,26.43 | C18.1 57.27,13.63 57.65,13.63 58.66,14.65 Q2.P3 | C19.1 58.29,17.64 59.78,16.14 59.78,15.63 Q2.P3 | v4.24,34.49 4.77,35.02 C4.2 C5.2
  Top 0.406: v47.64,30.94 47.02,30.93 45.67,30.93 v45.61,30.79 | U6.VSS 64.89,46.25 v64.86,46.23 | C37.2 55.71,41.49 v55.31,41.41 | 31.94,16.43 31.88,16.37 C14.1 33.72,18.21 C15.- v32.96,19.35 | v28.44,14.9 29.1,15.56 29.3,15.76 C13.1 29.19,15.8 29.76,16.37 31.18,16.37 C12.- | U11.13 74.57,27.61 74.57,25.52 74.16,25.11 C33.1 | v60.29,13.15 | v60.29,13.15 Q2.P3 | C1.2 12.56,4.35 13,4.79 13.86,4.79 U1.PP@1 | JP4.4 8.93,22.27 v9.19,22.01
  Top 0.61: C22.2 65.25,2.87
  Top 0.813: U$2.GND U$2.DGND U$2.GND | PROG.1 15.41,21.66 U$2.GND | U$2.GND 15.07,20.64 v13,20.64 | JP4.12 8.93,12.01 v8.58,11.65 | JP4.11 v3.85,11.8
  Bottom 0.203: v50.34,36.45 50.54,37.44
  Bottom 0.254: 32.66,20.98 32.71,21.59 | 45.36,30.83 45.36,30.68 45.46,30.58 | v47.64,30.94 47.64,31.4 | v15.19,34.72 15.19,34.09 | v9.29,32.51 9.47,32.82 | v8.51,36.63 7.57,35.99 | v12.7,38.05 13.3,38.05 13.61,38.35 | v38.91,36.8 39.21,36.8 | v40.43,40.15 40.73,40.15 | 30.07,9.36 29.76,9.06 | v32.96,19.35 33.11,19.42 | v29.15,11.19 29.15,10.89
  Bottom 0.305: 15.22,29.38 15.27,29.38 | v60.29,13.15 60.52,13.53 | v14.67,26.43 14.67,26.28 14.37,25.98
  Bottom 0.406: v45.61,30.79 45.61,30.58 45.61,30.69 | v64.86,46.23 64.86,46.08 65.17,45.77 | v55.31,41.41 54.7,40.9 54.65,40.95 | v9.19,22.01 9.8,22.01
  Bottom 0.61: U100.P$21 v6.85,42.18 | U100.P$22 9.39,42.64 v9.39,42.18 | U100.P$24 11.93,42.43 | U100.P$26 14.47,42.64 v14.47,42.18 | U100.P$27 15.74,42.43
  Bottom 0.813: v13,20.64 11.93,21.1 11.93,21.55 | v8.58,11.65 7.82,11.65 7.66,11.5 | v3.85,11.8 4.16,11.8 4.46,11.5
  other vias: 74.26,30.39 74.26,33.44 74.26,31.92 73.53,41.55 65.79,4.29 65.57,9.36 65.64,19.32 66.66,19.32 72.13,25.82 72.74,24.91 73.53,43.45 73.53,45.35 73.53,47.26 3.04,49.16 3.04,47.9 3.04,46.62 3.04,45.35 3.04,44.09 3.04,42.81 4.31,42.18 5.58,42.18 18.91,49.16 18.91,47.9 18.91,46.62 18.91,45.35 18.91,44.09 17.64,42.18 11.93,42.18 16.38,42.18 17.57,2.51 18.94,2.51 20.31,2.51 21.68,2.51 6.44,11.8 1.57,11.8 64.88,3.68 18.91,42.81
  pour Bottom (isolate 0.254, rank 2): -0.87,50.13 81.92,49.45 81.32,-2.81 -0.91,-2.41
  pour Top (isolate 0.254, no thermals): 65.27,19.73 68.01,19.57 67.86,2.35 65.12,2.51 64.51,3.11 64.51,5.1 65.12,5.1
  pour Top (isolate 0.203): 76.09,24.6 71.52,24.6 71.52,26.13 71.82,28.57 73.04,28.57 73.04,47.77 80.51,47.9 80.51,43.45 76.09,40.91
  pour Top (isolate 0.61): 0.68,49.83 21.38,49.67 21.3,41.95 0.58,41.95 0.65,49.8 0.68,49.8
  pour Top: 2.94,4.49 2.94,3.27 3.85,2.35 8.73,2.35 9.95,3.27 15.74,3.27 15.74,1.74 23.21,1.74 23.21,5.25 16.5,5.25 16.04,6.32 12.39,6.32 11.78,5.71 9.95,5.71 9.34,5.1 3.55,5.1
  pour Top (isolate 0.406, rank 2): 0.8,13.48 0.8,2.2 1.57,1.44 7.21,1.44 8.27,2.51 8.27,10.28 9.95,12.56 10.56,13.33 10.41,13.48
L
  pour Top: 14.06,7.08 13.45,7.69 13.45,8.14 14.06,8.6 14.37,8.14 14.22,7.08
LED0
  Top 0.254: U2.100 29.98,32.45 28.47,32.45 24.58,36.34 24.58,37.7 24.26,38.02 LED2.A
LED1
  Top 0.254: 23.58,36.4 LED1.A 23.58,36.27 33.88,25.98 34.15,25.98 U2.1
LORA_RST_N  (via drill 0.3)
  Top 0.203: 30.37,37.04 30.37,40.54 30.37,40.76 v30.07,41.06 | 20.92,39.39 21.38,38.93 23.36,38.93 24.58,38.93 LORA_RST_N.TP 25.8,38.93 v26.71,38.93
  Top 0.254: 20.92,39.39 v20.77,39.39 | U2.96 30.37,34.9 30.37,37.04
  Top 0.305: v20.77,39.39 20.62,39.54 R12.1
  Bottom 0.305: 20.82,39.34 v20.77,39.39 20.77,36.59 U100.P$32 | v26.71,38.93 27.93,38.93 v30.07,41.06
M1IN1
  Top 0.254: U2.52 57.37,27.58 U11.10
M1IN2
  Top 0.254: U2.53 57.16,28.08 U11.9
M2IN1
  Top 0.254: U2.54 56.95,28.59 U11.8
M2IN2
  Top 0.254: U2.55 56.71,29.07 U11.7
M3IN1
  Top 0.254: U2.56 56.59,29.63 64.91,29.63 67.96,32.68 72.99,37.71 73.04,37.76 U12.10
M3IN2
  Top 0.254: U12.9 72.79,38.27 64.66,30.14 56.37,30.14 U2.57
M4IN1
  Top 0.254: U12.8 72.54,38.78 64.46,30.7 56.21,30.7 U2.58
M4IN2
  Top 0.254: 73.78,39.29 U12.7 72.31,39.26 72.21,39.26 64.25,31.31 64.15,31.21 56.04,31.21 U2.59
M5IN1
  Top 0.203: U4.10 58.31,6.37 50.84,13.83 50.71,13.83 49.62,13.83 49.28,13.83 U2.27
M5IN2
  Top 0.203: U4.9 58.41,6.87 51.15,14.14 50.99,14.29 49.54,14.29 U2.28
M5OUT1
  Top 0.305: U4.2 68.32,5.86 68.47,5.71 | 68.47,2.66 68.47,2.2 68.47,2.15 72.64,2.15 RS1.I1
  pour Top (no thermals): 68.32,5.86 68.62,5.86 68.62,2.35 73.19,2.35 73.19,2.05 68.32,2.05
M6IN1
  Top 0.203: U4.8 58.51,7.38 51.2,14.7 51.15,14.75 49.8,14.75 U2.29
M6IN2
  Top 0.203: U2.32 50.54,16.13 50.54,16.02 58.69,7.87 64.28,7.87 U4.7
M7IN1
  Top 0.203: U2.36 52.37,17.14 52.47,17.14 52.93,16.68 52.93,15.76 52.93,15.61 54.91,13.63 55.62,12.92 56.02,12.92 57.75,11.19 61.46,11.19 61.61,11.19 63.75,13.33 63.75,15.89 64.79,16.98 64.89,16.98 65.58,16.98 | 65.58,16.98 U5.10 65.58,16.98
M7IN2
  Top 0.203: U2.37 51.51,18.71 53.38,16.83 53.38,15.76 55.21,13.94 55.82,13.33 56.23,13.33 57.95,11.6 61.46,11.6 61.46,11.65 63.29,13.48 63.29,16.07 63.82,16.6 64.74,17.52 65.6,17.52 U5.9
M8IN1
  Top 0.203: U2.38 51.84,18.98 52.77,18.05 53.69,17.14 53.84,16.98 53.84,16.83 53.84,15.92 55.52,14.24 56.02,13.73 56.43,13.73 58.16,12.01 61.16,12.01 61.21,12.01 62.83,13.63 62.83,13.78 62.83,16.3 63.37,16.83 64.51,17.97 64.58,18.05 U5.8
M8IN2  (via drill 0.3)
  Top 0.203: v58.26,12.79 58.64,12.41 58.79,12.41 60.55,12.41 60.85,12.41 62.37,13.94 62.37,14.54 62.37,14.85 62.37,15.31 62.37,16.45 62.91,16.98 64.36,18.43 64.43,18.51 65.6,18.51 U5.7
  Top 0.254: U2.39 53.12,18.51 v53.23,18.51
  Bottom 0.254: v53.23,18.51 53.99,17.75 53.99,16.53 53.99,15.62 55.52,14.09 56.58,14.54 v58.26,12.79
M1234SLEEP  (via drill 0.3)
  Top 0.254: U2.51 57.06,26.59 70.6,26.59 | 70.6,26.59 v71.21,26.59 | v71.21,26.59 72.38,26.59 | 72.38,26.59 U11.12 | U11.11 73.75,27.09 72.69,27.09 72.38,26.79 72.38,26.59 | U12.11 73.2,37.25 72.74,36.8 | 72.74,36.8 72.43,36.49 72.43,34.36 72.74,34.05 v72.74,30.09 | U12.12 72.76,36.77 72.74,36.8 | v71.21,26.59 70.6,26.59
  Bottom 0.254: v72.74,30.09 72.74,28.11 v71.21,26.59
M5678SLEEP  (via drill 0.3)
  Top 0.203: U2.33 51.25,16.14 51.25,15.92 53.99,13.17 56.48,10.68 56.74,10.68 v56.94,10.68 61.66,10.68 61.93,10.68 C21.1 64.36,13.33 64.36,13.94 64.36,14.7 VCCMOT.TP 65.42,15.76 65.42,15.99 65.65,16.07 U5.12
  Top 0.254: U4.12 65.14,5.38 64.55,5.38 C22.1 61.9,5.81 58.36,5.81 57.45,5.81 56.94,6.32 v56.94,6.77 | v56.94,10.68 56.74,10.68
  Bottom 0.254: v56.94,6.77 v56.94,10.68
N$1
  Top 0.254: U2.12 39.38,18.11 38.83,18.11 38.23,17.5 L2.1
  Top 0.305: 38.23,17.5 L2.1
  Top 0.406: L2.1 36.94,16.27 C15.+ 35.91,15.98 C14.2
N$2
  Top 0.305: U1.1 16.69,6.83 C8.1
N$4  (via drill 0.3)
  Top 0.305: 3V.C 17.72,13.48 v17.87,13.33
  Bottom 0.305: v17.87,13.33 17.87,12.19 R102.2
N$5
  Top 0.305: R11.2 LED2.C
N$6
  Top 0.305: R10.2 19.41,36.57 LED1.C
N$7
  cutout Bottom: 54.22,16.14 54.45,17.99 53.44,19.06 52.16,20.33 52.16,20.96 52.8,21.6 53.44,21.6 55.52,19.51 57.19,19.43 58.78,17.84 58.58,16.86 60.74,14.29 59.15,12.71 56.88,15.18 55.61,14.46
N$8
  Top 0.254: U2.41 54.41,18.61 Q2.P2 54.41,16.49 C18.2
N$10
  Top 0.254: U2.42 54.71,19.03 Q2.P1 | 55.35,19.03 56.95,19.03 C19.2
  Top 0.305: 55.35,19.03 Q2.P1
N$13
  Top 0.254: U12.2 76.57,37.25 76.57,36.87 arc23 77.18,33.88
  Top 0.406: 77.18,33.88 77.31,32.88 M3/M4.1
N$14
  Top 0.254: R8.1 27.18,6.82 T2.3 28.16,6.85 29.15,7.84 29.76,7.84 30.98,9.06 30.98,8.98 T1.1
N$15
  Top 0.305: U7.5 74.87,5.4 75.48,4.79 RS1.V2
N$16
  Top 0.305: 76.59,37.23 76.7,35.68 | 76.7,35.68 76.95,34.43 78.7,32.88 | 76.7,35.68 77.25,33.06 76.95,34.38 78.02,33.11 77.36,33.98 78.17,33.16
N$17
  Top 0.305: U7.4 74.04,4.75 RS1.V1
N$18
  Top 0.254: C2.2 10.93,32.56 IC1.9
N$19
  Top 0.254: IC1.27 10.43,38.63 Q1.2 8.41,39.17 C6.1
N$20
  Top 0.203: U5.11 65.12,16.53 64.66,16.07 MOD.TP
N$21
  Top 0.406: RS1.I2 77.26,2.05 M5/M6.1
N$22
  Top 0.254: U4.11 63.39,5.86 MOD..TP
N$23
  Top 0.305: U8.4 74.24,10.18 73.86,10.18 72.74,9.06 RS2.V1
N$24
  Top 0.305: U8.5 74.87,10.89 75.49,10.27 RS2.V2
N$25
  Top 0.305: 72.43,7.53 RS2.I1 70.76,7.53 70.6,7.53 69.94,6.87 U4.4
N$26
  Bottom 0.305: R102.1 16.55,10.27 R101.1 15.09,10.29 LED5_J.2
N$27
  Top 0.406: RS2.I2 77.67,7.53 M5/M6.3
N$28
  Top 0.305: U9.5 75.18,16.37 75.49,16.06 RS3.V2
N$29
  Top 0.305: RS3.V1 74.04,15.72 U9.4
N$30
  Top 0.305: U10.5 75.02,21.86 75.33,21.55 75.33,20.07 RS4.V2
N$31
  Top 0.305: U10.4 73.61,21.21 73.35,20.95 72.89,20.49 72.89,20.06 RS4.V1
N$32
  Top 0.406: 75.52,12.99 78,12.99 M7/M8.1
  Top 0.61: RS3.I2 75.52,12.99
N$33
  Top 0.254: U2.44 55.48,19.66 57.38,19.66 57.81,20.09 R14.1
N$34
  Top 0.254: U2.14 40.1,17.39 40.1,16.84
  Top 0.305: 40.1,16.84 39.49,16.23 L2.2
N$35
  Top 0.305: RS4.I1 70.6,18.51 69.99,17.9 69.64,17.54 U5.4
N$36
  Top 0.305: RS3.I1 69.08,13.02 68.47,13.63 68.47,15.76 68.47,16.37 68.32,16.53 U5.2
N$37
  Top 0.406: RS4.I2 77.56,18.51 M7/M8.3
N$38  (via drill 0.3)
  Top 0.305: U4.3 68.83,6.37 69.03,6.16 69.03,4.89 v69.18,4.79
  Bottom 0.305: v69.18,4.79 72.28,4.79
  Bottom 0.406: v69.18,4.79 72.28,4.79 76.7,4.79 77.46,4.79 M5/M6.2
N$39
  Top 0.305: U12.3 76.72,37.76 77.03,37.61 77.77,36.2 | 77.77,36.2 77.89,35.98 | M3/M4.2 78.02,35.96 77.69,35.8 77.31,36.2 77.77,36.2
N$40
  Top 0.305: 78.75,38.32 77.92,38.31 U12.4
  Top 0.406: M3/M4.3 77.92,38.31
N$41
  Top 0.305: 77.64,40.76 76.52,38.88 76.42,38.78 U12.5
  Top 0.406: 77.64,40.76 M3/M4.4
N$42
  Top 0.254: U1.7 13.64,2.79 | 13.64,2.79 R7.2 | R6.1 13.03,2.17 13.64,2.79
N$43  (via drill 0.3)
  Top 0.305: U4.5 69.54,7.38 69.69,7.53 70.45,8.3 v71.21,8.3
  Bottom 0.406: 71.67,8.45 75.79,8.45 77.31,9.67 77.95,10.28 77.95,10.36 M5/M6.4 | 71.67,8.45 71.52,8.45 71.67,8.45 | 71.67,8.45 v71.21,8.3
N$44  (via drill 0.3)
  Top 0.305: BAT.C 15.28,12.26 v15.44,12.11
  Bottom 0.305: v15.44,12.11 16.11,12.11 R101.2
N$45  (via drill 0.3)
  Top 0.305: v71.21,19.27 70.45,19.27 69.39,18.2 69.23,18.05 U5.5
  Bottom 0.406: v71.21,19.27 72.55,20.61 78,20.61 M7/M8.4
N$46
  Top 0.254: T3.1 37.08,36.87 37.08,41.06 37.08,42.28 37.38,42.59 37.38,44.72 38.54,45.88 DIGITAL_IO1.9
N$47  (via drill 0.3)
  Top 0.406: T2.2 30.19,6.92 v31.29,7.84
  Bottom 0.406: 5VEXT.1 32.2,6.92 v31.29,7.84
N$49
  Top 0.305: U11.2 76.52,27.07 76.57,25.88 76.9,24.71
  Top 0.61: 77.16,24.22 arc-1 76.9,24.71
  Top 0.813: M1/M2.1 77.16,24.22
N$50
  Top 0.305: U11.3 76.67,27.58 76.87,27.48 77.08,27.12 | 77.08,27.12 78.04,25.8 77.64,25.8 | 77.64,25.8 77.31,25.8 77.23,25.8 77.08,27.12 | 77.08,27.12 77.64,25.8
  Top 0.406: M1/M2.2 77.31,25.8
N$51
  Top 0.305: U11.4 76.42,28.08 | 76.42,28.08 77.64,28.08 77.64,27.83 77.03,28.03 | 77.03,28.03 76.82,28.24 | 76.82,28.24 76.42,28.08 | 76.42,28.08 77.64,28.64 77.64,28.24 76.82,28.24 | 76.42,28.08 77.03,28.03
  Top 0.406: 77.64,28.24 M1/M2.3
N$52
  Top 0.305: U11.5 76.31,28.59 77.43,30.07 76.42,28.69 77.2,30.22 77.08,29.76
  Top 0.406: 77.43,30.07 77.84,30.07 77.92,30.14 77.31,30.14 77.31,30.45 M1/M2.4
N$54  (via drill 0.3)
  Top 0.305: U5.3 69.03,17.03 69.69,16.37 v69.69,15.76
  Bottom 0.406: v69.69,15.76 77.77,15.76 M7/M8.2
N$55
  Top 0.254: DIGITAL_IO1.10 38.3,43.03 38.3,42.59 38.3,40.22 T4.1
N$59
  Top 0.305: 75.91,37.76 76.77,37.76 76.97,37.66 77.18,37.3 | 77.18,37.3 78.14,35.98 77.74,35.98 | 77.74,35.98 77.41,35.91 77.18,37.3 | 77.18,37.3 77.74,35.98 | 77.74,35.98 78.68,35.81
N$60
  Top 0.305: 75.91,38.27 76.52,38.27 | 76.52,38.27 77.74,38.27 77.74,38.02 77.13,38.22 | 77.13,38.22 76.92,38.42 | 76.92,38.42 76.52,38.27 | 76.52,38.27 77.74,38.83 77.74,38.42 76.92,38.42 | 76.52,38.27 77.13,38.22 | 77.13,38.22 78.68,38.35
N$61
  Top 0.305: 75.91,38.78 76.42,38.78 77.53,40.25 76.52,38.88 77.33,40.86 77.18,39.95 78.68,40.89
N$73
  Top 0.254: IC1.26 10.93,38.51 Q1.1 13.06,39.17 C7.1
N$76  (via drill 0.3)
  Top 0.254: U2.94 40.12,26.54 40.12,25.55 v39.62,25.05 | v30.78,25.25 26.41,25.25 26.24,25.25 PROG.6
  Bottom 0.254: v39.62,25.05 32.2,25.05 32.1,25.15 30.88,25.15 v30.78,25.25
N$77  (via drill 0.3)
  Top 0.254: U2.95 39.41,26.54 39.41,25.96 38.7,25.25 38.7,24.74 v38.5,24.39 | v31.39,24.44 24.27,24.44 24.22,24.44 PROG.5
  Bottom 0.254: v38.5,24.39 38.3,24.44 v31.39,24.44
P1.0  (via drill 0.3)
  Top 0.254: U2.4 36.82,21.19 36.47,21.19 33.83,23.83 28.59,29.26 v27.17,30.69 | v28.54,36.58 28.59,38.66 27.78,39.42 24.63,42.57 24.63,44.71 25.19,45.22 DIGITAL_IO1.19
  Bottom 0.254: v28.54,36.58 28.54,32.06 v27.17,30.69
P2.1
  Top 0.254: U2.17 43.49,18.66 43.88,18.66 46.42,16.12 46.42,15.1 42.87,11.55 DIGITAL_IO2.8
P2.4
  Top 0.254: U2.20 35.3,8.35 35.3,6.16
  Top 0.813: 35.3,6.16 35.3,6.32 DIGITAL_IO2.2
P2.5
  Top 0.254: U2.21 36.52,8.88 36.52,5.25 35.25,3.98 DIGITAL_IO2.1
P2.6
  Top 0.254: U2.22 37.79,9.43 DIGITAL_IO2.4
P2.7
  Top 0.254: U2.23 39.06,9.99 39.06,5.15 37.79,3.88 DIGITAL_IO2.3
P5.6  (via drill 0.3)
  Top 0.254: U2.70 52.37,35.33 52.37,36.64 51.1,37.91 v51.1,37.96 | v48.56,40.5 47.08,39.03 47.08,38.57 46.32,37.81 45.76,37.81 43.68,39.89 DIGITAL_IO1.6
  Bottom 0.254: v51.1,37.96 v48.56,40.5
P5.7  (via drill 0.3)
  Top 0.254: DIGITAL_IO1.5 42.56,44.76 42.56,38.73 43.88,37.41 v43.88,36.39 | v46.22,30.09 46.32,30.19 47.74,30.19 48.15,30.19 48.56,30.6 48.56,31 48.15,31.41 48.15,31.82 48.25,31.92 48.35,32.02 49,32.66 U2.71
  Bottom 0.254: v43.88,36.39 44.09,36.19 44.09,35.07 44.09,34.97 46.22,32.83 46.42,32.63 46.42,30.6 46.22,30.39 v46.22,30.09
P6.6
  Top 0.254: U2.80 42.82,33.73 42.82,36.27 42.82,37.46 41.95,38.32 41.95,42.52 DIGITAL_IO1.8
P6.7
  Top 0.254: U2.81 42.26,33.6 42.26,34.95 42.26,37.1 41.34,38.01 41.34,41.37 39.82,42.89 39.82,44.55 39.87,44.6 DIGITAL_IO1.7
P7.0
  Top 0.203: U2.88 40.37,30.53 39.67,30.53 39.06,30.53 37.33,32.26 36.06,33.53 DIGITAL_IO1.12 36.06,43.09
P7.1
  Top 0.203: U2.89 40.01,30.18 39.01,30.18 38.7,30.18 38.4,30.48 34.79,34.09 34.79,42.74 34.79,44.76 35.91,45.88 DIGITAL_IO1.11
P7.2
  Top 0.203: U2.90 39.68,29.82 38.7,29.82 38.35,29.82 37.99,30.18 33.52,34.65 DIGITAL_IO1.14
P7.3
  Top 0.203: U2.91 39.32,29.47 38.3,29.47 37.99,29.47 37.63,29.82 32.25,35.21 32.25,44.4 33.52,45.67 DIGITAL_IO1.13
P7.4
  Top 0.254: DIGITAL_IO2.7 42.87,4.13 44.14,5.4 44.14,7.43 44.14,11.95 47.24,15.05 47.38,15.05 U2.26
P8.0  (via drill 0.3)
  Top 0.203: v46.78,18.25 47.24,17.8 47.8,17.8 48.2,17.39 48.2,17.14 48.2,17.09 49.02,16.27 U2.30 | DIGITAL_IO2.10 45.61,6.52 v45.61,12.36
  Bottom 0.203: v45.61,12.36 45.61,12.72 46.12,13.22 46.12,15.66 45.81,15.97 45.81,17.03 46.68,17.9 v46.78,18.25
P8.1  (via drill 0.3)
  Top 0.203: DIGITAL_IO2.9 46.68,5.04 46.68,7.33 | 46.68,7.33 46.68,7.38 | 48.3,18.05 v47.9,18.46 48.3,18.05 | 48.3,18.05 48.61,17.75 48.61,17.34 U2.31 | v46.63,12.56 46.68,12.51 46.68,7.33
  Bottom 0.203: v46.63,12.56 46.63,12.61 46.63,15.87 46.27,16.22 46.27,16.83 v47.9,18.46
P9.2  (via drill 0.3)
  Top 0.254: 49.12,35.77 v49.01,35.87 49.01,34.81 U2.74 | v46.52,39.52 46.47,39.83 46.47,43.34 DIGITAL_IO1.4
  Bottom 0.254: 46.63,39.42 v46.52,39.52 49.01,37.04 49.01,36.88 v49.01,35.87
P9.3  (via drill 0.3)
  Top 0.254: U2.75 48.1,34.58 v48.15,35.11 | v46.17,38.71 44.95,39.93 44.95,44.55 46.22,45.82 DIGITAL_IO1.3
  Bottom 0.254: v48.15,35.11 arc-90 48.2,35.21 48.2,36.68 v46.17,38.71
P9.5
  Top 0.203: 29.86,36.33 29.86,39.98 27.22,42.62 27.22,44.66 DIGITAL_IO1.17
  Top 0.254: U2.97 29.86,34.69 29.86,36.33
P10.2  (via drill 0.3)
  Top 0.254: U2.2 37.89,23.69 37.89,24.03 37.48,24.44 36.87,24.44 29.76,31.55 v29.66,31.55 | v29.2,35.82 29.2,37.65 29.2,39.37 26.36,42.22 26.36,42.88 DIGITAL_IO1.20
  Bottom 0.254: v29.66,31.55 29.56,31.65 29.2,32.01 v29.2,35.82
P10.4
  Top 0.254: U2.24 40.33,10.54 DIGITAL_IO2.6
P10.5
  Top 0.254: U2.25 41.6,11.12 41.6,5.2 40.33,3.93 DIGITAL_IO2.5
PJ.2
  Top 0.203: U2.85 41.45,31.58 41.45,32.06 41.75,32.36 41.75,34.19
  Top 0.254: 41.75,34.19 41.75,34.55 40.23,36.07 40.23,37.59 T4.3
PJ.3  (1 unrouted)
  Top 0.203: 41.24,34.09 41.24,32.46 41.04,32.26 41.04,31.24 41.12,31.17 41.14,31.17 U2.86
  Top 0.254: 39.53,35.8 41.24,34.09
PJ.4
  Top 0.203: U2.92 38.96,29.11 37.79,29.11 37.69,29.11 37.28,29.52 31.59,35.21 31.59,41.91 30.98,42.52 DIGITAL_IO1.16
PJ.5
  Top 0.203: U2.93 38.63,28.76 37.53,28.76 37.38,28.76 30.98,35.11 30.98,36.22 | 30.98,37.54 30.98,41.41 29.71,42.67 29.71,44.6 DIGITAL_IO1.15
  Top 0.254: 30.98,35.31 30.98,36.22 30.98,37.54
RFGND
  cutout Bottom (isolate 0.813): 7.79,49.77 13.43,49.72 13.45,43.91 7.82,43.96
RST_N  (via drill 0.3)
  Top 0.254: U2.83 44.81,29.62 45.36,29.62 v46.02,28.96 | v32.2,23.62 22.45,23.62 22.2,23.62 PROG.4 | v43.43,26.37 42.16,26.37 41.89,26.37 40.43,24.91 39.25,23.73 v39.06,23.73
  Top 0.305: PROG.4 17.99,28.5 | 17.99,28.5 16.89,28.5 C11.2 | 17.99,28.5 17.99,29.6 R9.2
  Bottom 0.254: v32.2,23.62 32.3,23.73 v39.06,23.73 | v46.02,28.96 v43.43,26.37
RX0
  Top 0.254: U2.6 36.95,19.92 36.31,19.92 33.42,22.81 arc16 33.27,22.93 | 31.74,22.93 32.05,22.93 | 32.05,22.93 33.27,22.93 | 33.27,22.93 33.3,22.93 | 32.05,22.93 21.99,22.93 20.38,22.93 PROG.3
RX1
  Top 0.254: RX1/TX1.3 27.63,4.18 28.54,5.1 29.76,5.1 30.07,5.1 30.98,6.01 30.98,6.62 32.2,7.84 33.35,7.84 U2.18
RX2  (via drill 0.3)
  Top 0.254: U2.34 50.43,17.65 51.4,16.68 51.66,16.42 51.71,16.12 51.71,16.07 52.06,15.76 52.16,15.76 52.32,15.61 54.45,13.48 55.52,12.41 v55.77,12.31 | RX2/TX2.3 53.48,4.23 v53.48,9.31
  Bottom 0.254: v55.77,12.31 55.77,12.21 55.77,11.65 53.74,9.62 v53.48,9.31
RX3  (via drill 0.3)
  Top 0.254: U2.98 27.76,36.07 27.64,36.19 v27.02,36.19 | v23.82,32.98 23.21,32.98 18.18,32.98 12.23,27.04 v8.43,27.04
  Bottom 0.254: v27.02,36.19 24.12,33.29 v23.82,32.98 | v8.43,27.04 7.36,27.04 7.13,27.04 6.9,27.04 3.85,23.99 3.7,23.84 U100.P$6
SCL  (via drill 0.3)
  Top 0.254: U2.11 41.57,20.98 v42.03,20.98 42.06,20.95 42.82,20.95 43.58,20.18 43.58,19.73 46.73,16.58 v46.93,16.58 | R2.1 5.31,28.32 4.46,29.18 4.46,31.31 4.46,32.22 v5.07,32.83 | IC2.4 47.54,11.08 v47.54,12.41
  Top 0.305: v31.18,17.8 29.46,17.8 28.44,16.78 9.39,16.78 5.17,16.78 | R2.1 5.31,28.09 | 5.58,28.26 R2.1 | IC1.19 11.09,36.11 v10.36,35.37 | 5.31,27.87 R2.1 | 4.31,20.59 4.72,21 | 4.72,21 5.99,22.27 5.99,26.43 5.99,27.59 arc90 R2.1 | 4.36,20.64 4.72,21
  Top 0.406: 5.17,16.78 JP4.7 4.31,18.56 4.31,20.59 3.9,20.59 JP4.5
  Bottom 0.254: v46.93,16.58 47.13,16.32 47.13,13.12 47.54,12.72 v47.54,12.41 | 39.4,18.24 39.36,18.2
  Bottom 0.305: v42.03,20.98 39.49,18.33 39.4,18.24 | 39.36,18.2 38.95,17.8 v31.18,17.8 | v10.36,35.37 7.61,35.37 v5.07,32.83
SDA  (via drill 0.3)
  Top 0.203: 41.52,21.65 v41.52,21.69 41.52,21.65
  Top 0.254: U2.10 41.52,21.65 | IC1.20 14.2,37.02 v14.93,36.29 | IC2.3 47.97,10.4 48.25,10.68 48.61,11.04 v48.61,12.41 48.71,12.31 | v41.52,21.69 41.54,21.71 41.59,21.66 42.66,21.66 42.92,21.66 44.14,20.44 44.14,19.93 46.68,17.39 v47.49,17.19
  Top 0.305: v32.02,18.64 30.91,18.64 28.98,18.64 27.93,17.59 9.44,17.59 | 7.49,20.59 7.49,20.97 | v5.38,31.92 5.31,31.85 R3.1 6.44,28.96 6.6,28.81 arc-31 6.75,28.26 6.75,21.33 7.49,20.59 | 7.54,20.64 7.49,20.59
  Top 0.406: 9.44,17.59 JP4.8 JP4.6 7.54,20.64
  Bottom 0.254: 14.93,36.13 v14.93,36.29 12.64,36.29 11.02,34.66 8.12,34.66 7.82,34.36 v5.38,31.92 | v47.49,17.19 47.74,16.88 47.74,13.83 47.74,13.33 48.15,12.92 v48.61,12.41
  Bottom 0.305: v41.52,21.69 41.32,21.19 41.12,20.96 39.31,19.15 39.01,18.85 38.8,18.64 v32.02,18.64 | 14.88,36.34 v14.93,36.29
SPI_EXTSLAVE_TE  (via drill 0.3)
  Top 0.254: U2.76 45.3,34.24 50.64,39.58 v52.82,41.76
  Bottom 0.254: v52.82,41.76 SPI.1
SPI_FLASH_CS
  Top 0.254: R18.1 69.71,43 69.08,42.37 67.81,42.37 67.19,42.37 U6.CE 66.95,42.44 65.88,41.37 57.75,41.37 56.08,40 56.08,38.32 U2.69
SPI_MISO  (via drill 0.3)
  Top 0.254: SPI.2 50.03,44.6 50.03,42.47 50.03,40.8 45,35.77 44.24,35.77 43.48,35 43.48,33.78 U2.79 | U6.SO 64.64,43.71 v63.75,44.6
  Bottom 0.254: SPI.2 52.57,44.6 55.67,44.6 63.14,44.6 | 63.14,44.6 v63.75,44.6 | v63.75,44.6 63.9,44.6 | v63.75,44.6 63.14,44.6
SPI_MOSI
  Top 0.254: U2.78 43.93,34.05 43.93,34.55 44.54,35.16 45.31,35.16 52.62,42.47 52.62,44.76 53.74,45.88 SPI.4 58.65,45.88 U6.SI
SPI_SCK
  Top 0.254: U2.77 45.68,33.02 45.76,33.02 45.91,33.02 46.37,33.48 46.37,34.39 53.84,41.86 SPI.3 55.49,44.98 U6.SCK
TX0
  Top 0.254: U2.7 37.22,19.46 36.06,19.46 33.22,22.3 32.5,22.3 26.24,22.3 25.95,22.01 20.99,22.01 18.46,22.01 PROG.2
TX1
  Top 0.254: 30.17,3.93 RX1/TX1.2 30.68,3.88 31.89,5.1 33.42,5.1 34.03,5.71 34.03,7.79 U2.19
TX2  (via drill 0.3)
  Top 0.254: 52.32,16.53 v52.32,16.42 52.32,16.47 U2.35 | v50.79,13.02 53.64,10.18 55.57,8.25 RX2/TX2.2
  Bottom 0.254: v52.32,16.42 52.32,14.54 v50.79,13.02 | v50.79,13.02 50.74,12.97 v50.79,13.02
TX3  (via drill 0.3)
  Top 0.254: U2.99 29.82,33.29 28.85,33.29 v25.8,36.19 | v23.05,33.75 17.87,33.75 11.93,27.8 v7.51,27.8
  Bottom 0.254: v7.51,27.8 6.9,27.8 4.21,25.11 U100.P$7
  Bottom 0.305: v23.05,33.75 23.36,33.75 v25.8,36.19
V_MOTOR  (via drill 0.3)
  Top 0.305: C34.2 75.81,35.23 U12.1 | C33.2 75.81,25.28 U11.1
  Top 0.406: v75.79,33.75 75.79,34.67 C34.2
  Top 0.61: v75.79,33.75 75.79,34.82 | v76.09,23.99 75.65,24.44 C33.2
  Bottom 0.61: VMOT_SEL.2 76.88,41.85 75.79,40.76 v75.79,33.75 75.79,24.3 v76.09,23.99
V_MOTOR2  (via drill 0.6)
  Top 0.305: U5.1 67.71,15.99 67.71,15.61 67.71,15.15 67.56,15 67.4,15 | U4.1 67.66,5.15 67.71,5.1 67.71,4.25 C23.2
  Top 0.61: C26.2 67.4,14.85 67.4,15 | C26.2 67.49,14.63 | v66.79,9.97 66.64,10.12 66.64,13.48 66.95,13.78 67.49,14.33 C26.2 | v67.4,2.96 67.4,3.94 C23.2
  Bottom 0.61: v66.79,9.97 66.79,3.27 | 66.79,3.27 v67.4,2.96 66.94,2.96 | VMOT_SEL100.2 65.88,2.35 | 65.88,2.35 66.79,3.27 | 65.88,2.35 65.52,2.35 65.27,2.61 64.36,2.61 61.82,2.61 V_MOT1.2
V_MOTOR_ALT
  Bottom 1.016: VMOT_SEL.3 75.36,45.8 V_MOT2.2
VREF_M  (via drill 0.3)
  Top 0.254: U7.1 72.33,6.05 | U9.1 72.97,17.59 74.87,17.59 75.07,17.59 75.89,16.78
  Top 0.305: v73.35,22.47 73.31,22.51 U10.1 | 75.48,6.57 75.43,6.62 72.94,6.62 72.74,6.39 U7.1 | U8.1 72.97,12.11 74.57,12.11 75.18,12.11 arc-90 75.23,12.06
  Top 0.406: U3.2 70.43,1.05 70.91,0.57 78.28,0.57 79.7,2 79.7,6.67 | 79.7,6.67 79.7,11.7 | 79.7,11.7 79.7,16.73 | 79.7,16.73 79.7,21.2 79.04,21.86 77.16,21.86 76.85,21.55 v76.14,21.55 | 75.89,16.78 79.65,16.78 79.7,16.73 | 75.48,6.57 79.6,6.57 79.7,6.67 | 75.23,12.06 76.75,12.06 77.16,11.65 79.65,11.65 79.7,11.7
  Bottom 0.406: v76.14,21.55 74.26,21.55 v73.35,22.47

## Text on the board
tNames: GND | GND 3V3 | A1 AGND | A8 A9 | Octanis 1 v1.0 | GND 3V3 | TE MISO | CLK MOSI | mainboard | 3V3 | octanis.org | GND | GND | 3V3 | GND | 3V3 | 5V | GND | 5V_GND_BAT_GND
bNames: BAT V_mot V_ext | BAT V_mot 5V
tValues: HMC5883L